# Altium schematic sheet I2C Network.SchDoc: I2C Network Block Diagram
size 292 x 193 mm; DocumentNumber: 49; SheetNumber: 38; SheetTotal: 44
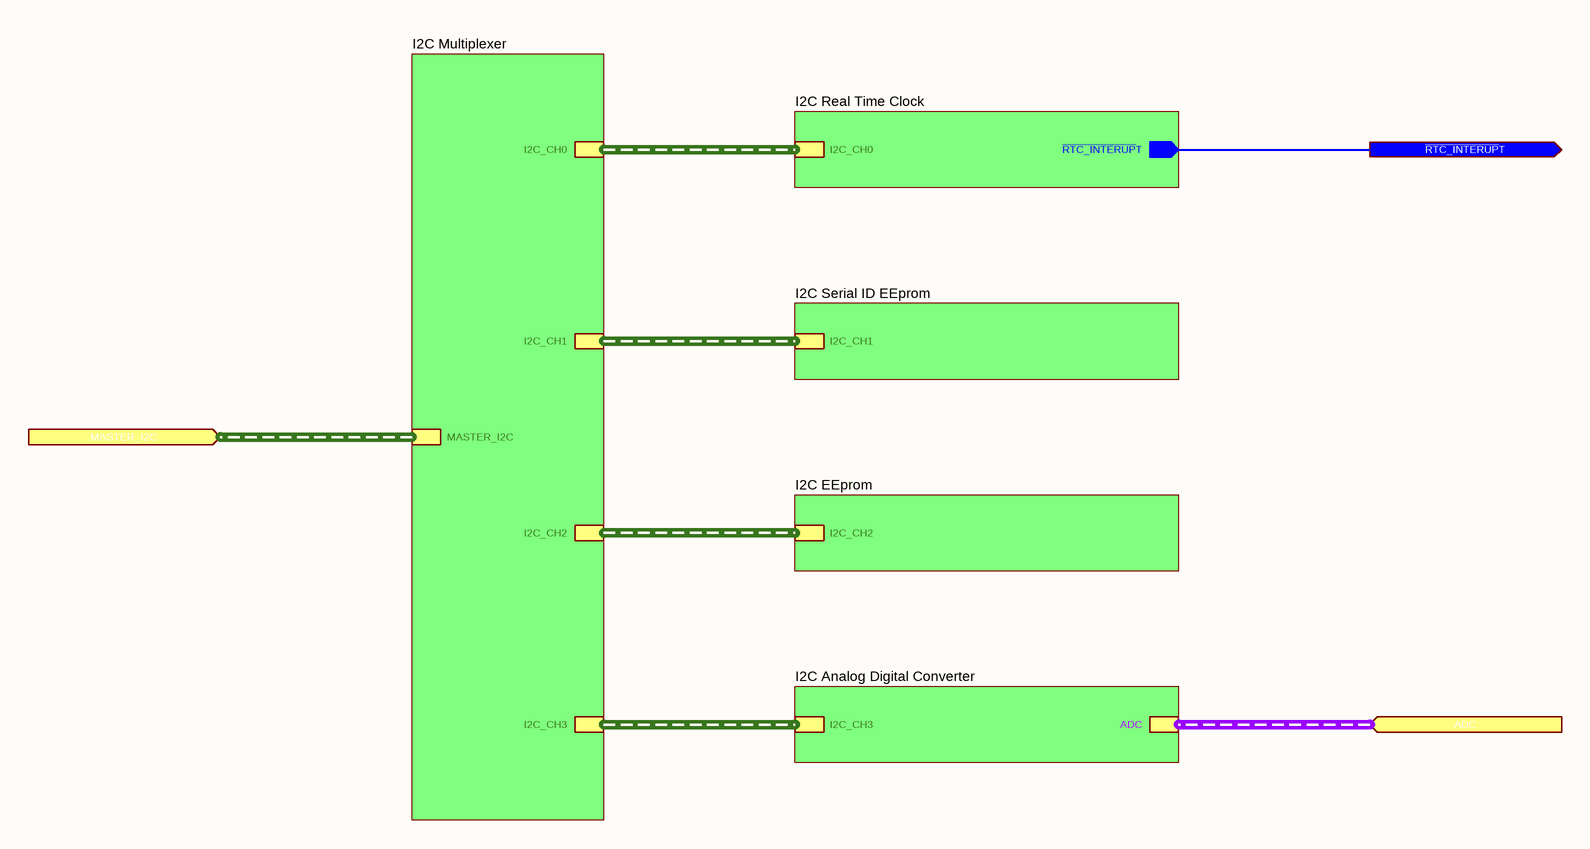
[diagram p0: I2C Network.SchDoc]

## Sub-sheets
I2C Analog Digital Converter = Analog Digital Converter.SchDoc: I2C_CH3 (harness I2C_CH3), ADC (harness ADC)
I2C EEprom = EEPROM.SchDoc: I2C_CH2 (harness I2C_CH2)
I2C Multiplexer = I2C Multiplexer.SchDoc: I2C_CH1 (harness I2C_CH1), I2C_CH2 (harness I2C_CH2), I2C_CH3 (harness I2C_CH3), I2C_CH0 (harness I2C_CH0), MASTER_I2C (harness MASTER_I2C)
I2C Real Time Clock = Real Time Clock.SchDoc: ~{RTC_INTERUP}T (out), I2C_CH0 (harness I2C_CH0)
I2C Serial ID EEprom = Serial ID EEPROM.SchDoc: I2C_CH1 (harness I2C_CH1)

## Ports
ADC (in, harness ADC), MASTER_I2C (in, harness MASTER_I2C), ~{RTC_INTERUP}T (out)

## Nets
~{RTC_INTERUP}T: port ~{RTC_INTERUP}T, sheet I2C Real Time Clock/~{RTC_INTERUP}T

## Buses and harness runs
harness port ADC = sheet I2C Analog Digital Converter/ADC
harness port MASTER_I2C = sheet I2C Multiplexer/MASTER_I2C
harness sheet I2C Analog Digital Converter/I2C_CH3 = sheet I2C Multiplexer/I2C_CH3
harness sheet I2C EEprom/I2C_CH2 = sheet I2C Multiplexer/I2C_CH2
harness sheet I2C Multiplexer/I2C_CH0 = sheet I2C Real Time Clock/I2C_CH0
harness sheet I2C Multiplexer/I2C_CH1 = sheet I2C Serial ID EEprom/I2C_CH1

## Notes on the sheet
- © 2021 All rights reserved.
  This document may not, in whole or in part, be copied, photocopied, reproduced, translated or converted to any electronic or machine readable from without prior written permission of Mehmet Günce Akkoyun.
  Engineer contact : akkoyun@me.com
- Property of
- Engineer :
- Date :
- Size :
- A4
- Time :
- Project :
- Page :
- /
- Customer :
- Product ID :
- Module ID :
- Version :
- File :
- Revision :